# Altium schematic sheet CAN_SN65HVD230D.SchDoc
size A3
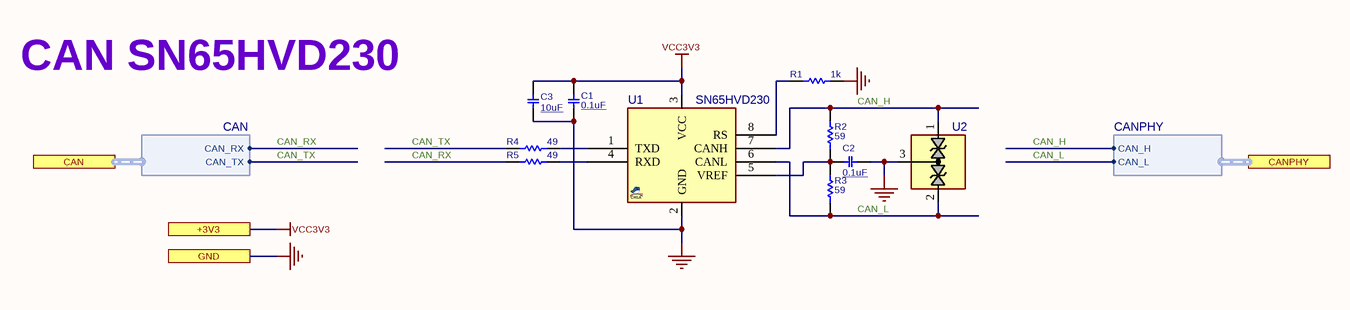
[diagram p0: CAN_SN65HVD230D.SchDoc]

## Parts
C1  0.1uF  [C0603]
C2  0.1uF  [C0603]
C3  10uF  [C0603]
R1  1k  [R0603]
R2  59  [R0603]
R3  59  [R0603]
R4  49  [R0603]
R5  49  [R0603]
U1  SN65HVD230  [SO_8]
U2  CDSOT23-SM712  [SOT23_3]  (value not drawn)

## Ports
+3V3, CAN (harness CAN), CANPHY (harness CANPHY), GND

## Harnesses
CANPHY: CAN_H, CAN_L
CAN: CAN_TX, CAN_RX

## Nets
GND: C1.1 C2.1 C3.2 R1.1 U1.2(GND) U2.3(NC) ; port GND
VCC3V3: C1.2 C3.1 U1.3(VCC) ; port +3V3
CAN_H: R2.2 U1.7(CANH) U2.1(NC) ; port CANPHY.CAN_H
CAN_L: R3.1 U1.6(CANL) U2.2(GND) ; port CANPHY.CAN_L
CAN_RX: R5.2 ; port CAN.CAN_RX
CAN_TX: R4.2 ; port CAN.CAN_TX
NetC2_2: C2.2 R2.1 R3.2 U1.5(VREF)
NetR1_2: R1.2 U1.8(RS)
NetR4_1: R4.1 U1.1(TXD)
NetR5_1: R5.1 U1.4(RXD)

## Notes on the sheet
- CAN SN65HVD230
- Title
- Size:
- Date:
- A3
- Number:
- Time:
- Revision:
- Sheet
- of
- File:

## Library data of the parts
C1 C2 = CAP_SMD_MLCC_0402: CAP, MLCC; PARAM: -, -%; MANF_P#: MANF_PART#; PARAM2: 50V; PRICE: 100= 1$; MANF: -; ASSEMBLY: ASSEMBLY; VALUE: 0.1uF
C3 = CAP_SMD_MLCC_0402: CAP, MLCC; PARAM: -, -%; MANF_P#: MANF_PART#; PARAM2: 25V; PRICE: 100= 1$; MANF: -; ASSEMBLY: ASSEMBLY; VALUE: 10uF
R1-R5 = RES_SMD_0402: RESISTOR, SMD; PARAM: -W; DESC: DESCRIPTION; DIST#: MOUSER; PARAM2: 1%; MANF_P#: -; MANF: -; ASSEMBLY: ASSEMBLY; PRICE: 100= 0.5$
  R1: VALUE: 1k
  R2 R3: VALUE: 59
  R4 R5: VALUE: 49
U1 = SN65HVD230_SOP8: CAN,  Transceivers, 3.3V (VDD); MANF: Texas Instruments; MANF_P#: SN65HVD230D, SN65HVD230QD; PARAM: -40~85oC; PRICE: 2.3$@MOUSER; PARAM2: 3.3V (VDD); PACKAGE: SOP-8; VALUE: SN65HVD230
U2 = TVS_X2_CDSOT23-SM712: TVS, ESD PROTECT, 2CH, 400W/17A PP, 7.5VBR, ±8KV ESDmin; MANF: Bourns; PARAM: 400W/17A peak-pulse; MANF_P#: CDSOT23-SM712; PARAM2: 7.5VBR, ±8KV ESD min; PRICE: 1.6$; VALUE: CDSOT23-SM712